# Altium project CPLD_Programmer.PrjPcb
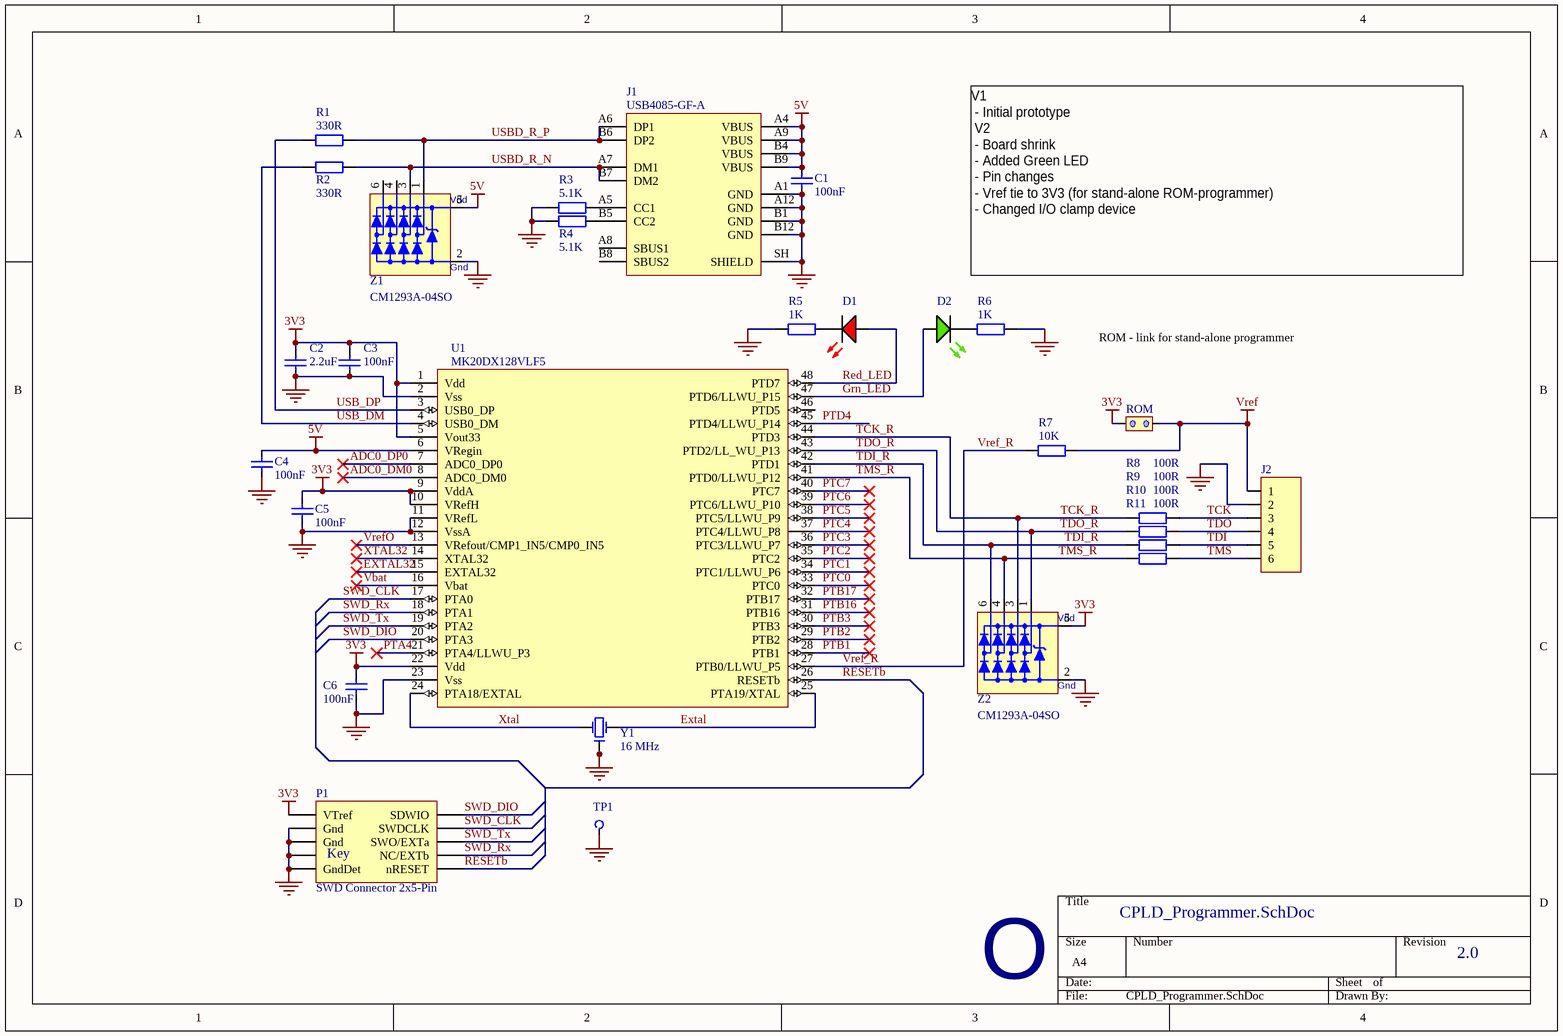
[diagram p0: CPLD_Programmer.SchDoc]
ProjectDescription: CPLD Programmer; ProjectRevision: V2
1 sheet, 29 parts. Net scope: global (net labels, ports and power ports of the same name join across sheets).
Board file: CPLD_Programmer.PcbDoc

## Sheet CPLD_Programmer.SchDoc
size A4; Revision: 2.0

### Parts
C1  100nF  [CCNP1608-0603_N]
C2  2.2uF  [CCNP1608-0603_N]
C3  100nF  [CCNP1608-0603_N]
C4  100nF  [CCNP1608-0603_N]
C5  100nF  [CCNP1608-0603_N]
C6  100nF  [CCNP1608-0603_N]
D1  LED Red  [LED1608-0603-RED_N]  (value not drawn)
D2  LED Green  [LED1608-0603-GREEN_N]  (value not drawn)
J1  USB4085-GF-A  [USB4085-GF-A]
J2  Header, 6-Pin  [SAMTEC-SMH-106-02-X-S]  (value not drawn)
Logo1  OSHW Logo  [OSHW]  (value not drawn)  (no BOM)
P1  SWD Connector 2x5-Pin  [SWD-2x5-Jig-Pads]  (no BOM)
R1  330R  [CR1608-0603_N]
R2  330R  [CR1608-0603_N]
R3  5.1K  [CR1608-0603_N]
R4  5.1K  [CR1608-0603_N]
R5  1K  [CR1608-0603_N]
R6  1K  [CR1608-0603_N]
R7  10K  [CR1608-0603_N]
R8  100R  [CR1608-0603]
R9  100R  [CR1608-0603]
R10  100R  [CR1608-0603]
R11  100R  [CR1608-0603]
ROM  LinkOpen  [SolderBridge(Open)]  (value not drawn)
TP1  TP  [TP]  (value not drawn)
U1  MK20DX128VLF5  [TSQFP50P900X900-48M]
Y1  16 MHz  [Crystal_SMD_3.2x2.5]
Z1  CM1293A-04SO  [SOT457_N]
Z2  CM1293A-04SO  [SOT457_N]

### Nets
3V3: C2.2 C3.2 C5.2 C6.2 P1.1(VTref) ROM.1 U1.1(Vdd) U1.5(Vout33) U1.9(VddA) U1.10(VRefH) U1.22(Vdd) Z2.5(Vp)
5V: C1.2 C4.2 J1.A4(VBUS) J1.A9(VBUS) J1.B4(VBUS) J1.B9(VBUS) U1.6(VRegin) Z1.5(Vp)
GND: C1.1 C2.1 C3.1 C4.1 C5.1 C6.1 J1.A1(GND) J1.A12(GND) J1.B1(GND) J1.B12(GND) J1.SH(SHIELD) J2.2 P1.0(Pins) P1.3(Gnd) P1.5(Gnd) P1.9(GndDet) R3.1 R4.2 R5.1 R6.1 TP1.1(TP) U1.2(Vss) U1.11(VRefL) U1.12(VssA) U1.23(Vss) Y1.2(Gnd) Y1.4(Gnd) Z1.2(Vn) Z2.2(Vn)
Vref: J2.1 R7.2 ROM.2
ADC0_DM0: U1.8(ADC0_DM0)
ADC0_DP0: U1.7(ADC0_DP0)
Extal: U1.25(PTA19/XTAL) Y1.3(OSC2)
EXTAL32: U1.15(EXTAL32)
Grn_LED: D2.A U1.47(PTD6/LLWU_P15)
PTA4: U1.21(PTA4/LLWU_P3)
PTB1: U1.28(PTB1)
PTB2: U1.29(PTB2)
PTB3: U1.30(PTB3)
PTB16: U1.31(PTB16)
PTB17: U1.32(PTB17)
PTC0: U1.33(PTC0)
PTC1: U1.34(PTC1/LLWU_P6)
PTC2: U1.35(PTC2)
PTC3: U1.36(PTC3/LLWU_P7)
PTC4: U1.37(PTC4/LLWU_P8)
PTC5: U1.38(PTC5/LLWU_P9)
PTC6: U1.39(PTC6/LLWU_P10)
PTC7: U1.40(PTC7)
PTD4: U1.45(PTD4/LLWU_P14)
Red_LED: D1.A U1.48(PTD7)
RESETb: P1.10(nRESET) U1.26(RESETb)
SWD_CLK: P1.4(SWDCLK) U1.17(PTA0)
SWD_DIO: P1.2(SDWIO) U1.20(PTA3)
SWD_Rx: P1.8(NC/EXTb) U1.18(PTA1)
SWD_Tx: P1.6(SWO/EXTa) U1.19(PTA2)
TCK: J2.3 R8.2
TCK_R: R8.1 U1.44(PTD3) Z2.3
TDI: J2.5 R10.2
TDI_R: R10.1 U1.42(PTD1) Z2.6
TDO: J2.4 R9.2
TDO_R: R9.1 U1.43(PTD2/LL_WU_P13) Z2.1
TMS: J2.6 R11.2
TMS_R: R11.1 U1.41(PTD0/LLWU_P12) Z2.4
USB_DM: R2.2 U1.4(USB0_DM)
USB_DP: R1.2 U1.3(USB0_DP)
USBD_R_N: J1.A7(DM1) J1.B7(DM2) R2.1 Z1.3
USBD_R_P: J1.A6(DP1) J1.B6(DP2) R1.1 Z1.1
Vbat: U1.16(Vbat)
Vref_R: R7.1 U1.27(PTB0/LLWU_P5)
VrefO: U1.13(VRefout/CMP1_IN5/CMP0_IN5)
Xtal: U1.24(PTA18/EXTAL) Y1.1(OSC1)
XTAL32: U1.14(XTAL32)
NetD1_K: D1.K R5.2
NetD2_K: D2.K R6.2
NetJ1_A5: J1.A5(CC1) R3.2
NetJ1_B5: J1.B5(CC2) R4.1

Not connected (* = marked no-connect by the designer): J1 A8(SBUS1) B8(SBUS2); U1 46(PTD5); Z1 4 6

### Notes on the sheet
- V1
  - Initial prototype
  V2
  - Board shrink
  - Added Green LED
  - Pin changes
  - Vref tie to 3V3 (for stand-alone ROM-programmer)
  - Changed I/O clamp device
- ROM - link for stand-alone programmer
- (in symbol CM1293A-04SO) Vdd; Gnd
- (in symbol OSHW Logo) O
- (in symbol SWD2X5_JIG) Key

### Library data of the parts
C1-C6 = Cap_CCNP_0603: Capacitor non-polar SMT 0603; Manufacturer: Generic Components; Class: Passive; Published: 08/06/2000; Publisher: Altium Hobart Technology Centre; SubClass: Capacitor; Farnell PN: *; Digikey: *
  C1 C3-C6: Value: 100nF; LCSC: C14663
  C2: Value: 2.2uF; LCSC: C23630
D1 = LED-0603-Red: LED 0603 Red; Manufacturer: Generic Components; Class I: Optoelectronic; Published: 8-Jun-2000; Revision: July-2002: Re-released for DXP Platform.; Publisher: Altium Limited; Class II: LED; Farnell PN: 1581239; Digikey: *; LCSC: C2286
D2 = LED-0603-Green: LED 0603 Green; Manufacturer: Generic Components; Class I: Optoelectronic; Published: 8-Jun-2000; Revision: July-2002: Re-released for DXP Platform.; Publisher: Altium Limited; Class II: LED; Farnell PN: 1581242; Digikey: *; LCSC: C72043
J1 = USB4085-GF-A: USB-C, USB 2.0 Receptacle Connector 16 Position Through Hole, Right Angle; Angle: 90; Part Number: USB4085-GF-A; Digikey Part Number: 2073-USB4085-GF-ACT-ND; Digikey Link: https://www.digikey.ee/product-detail/en/gct/USB4085-GF-A/2073-USB4085-GF-ACT-ND/9859733; Digikey: 2073-USB4085-GF-ACT-ND; Farnell PN: 2924867; LCSC: *
J2 = Header Female 1x6H-SMT: SAMTEC: SW-106-02-G-S-RA; LatestRevisionDate: 17-Jul-2002; LatestRevisionNote: Re-released for DXP Platform.; Publisher: Altium Limited; LCSC: *; Farnell PN: 2084265 (sim); Digikey: SAM15786-ND
P1 = SWD2X5_JIG: LatestRevisionDate: 17-Jul-2002; LatestRevisionNote: Re-released for DXP Platform.; Publisher: Altium Limited; Farnell PN: 1865285; LCSC: *
R1-R11 = Res_CR0603: Resistor SMT 0603; Manufacturer: Generic Components; Class: Passive; Published: 08/06/2000; Publisher: Altium Hobart Technology Centre; SubClass: Resistor; Farnell PN: *; Digikey: *
  R1 R2: Value: 330R; LCSC: C22775
  R3 R4: Value: 5.1K; LCSC: C23186
  R5 R6: Value: 1K; LCSC: C21190
  R7: Value: 10K; LCSC: *
  R8-R11: LCSC: C22775; Value: 100R
TP1 = TP: Test Point; Digikey: *; Farnell PN: *
U1 = MK20DX128VLF5: Arm Cortex M4
Y1 = Crystal 16MHz: Crystal SMD 3.2 x 2.5 x 0.7 mm; Manufacturer: Generic Components; Class: Oscillator; SubClass: Crystal Oscillator; Published: 08/06/2000; Publisher: Altium Hobart Technology Centre; Digikey: *; Farnell PN: *; LCSC: C13738
Z1 Z2 = CM1293A-04SO: Ultra low capacitance quadruple rail-to-rail ESD protection; Farnell PN: 2533258; Digikey: CM1293A-04SOOSCT-ND; LCSC: C393377
ROM = LinkOpen: LCSC: *